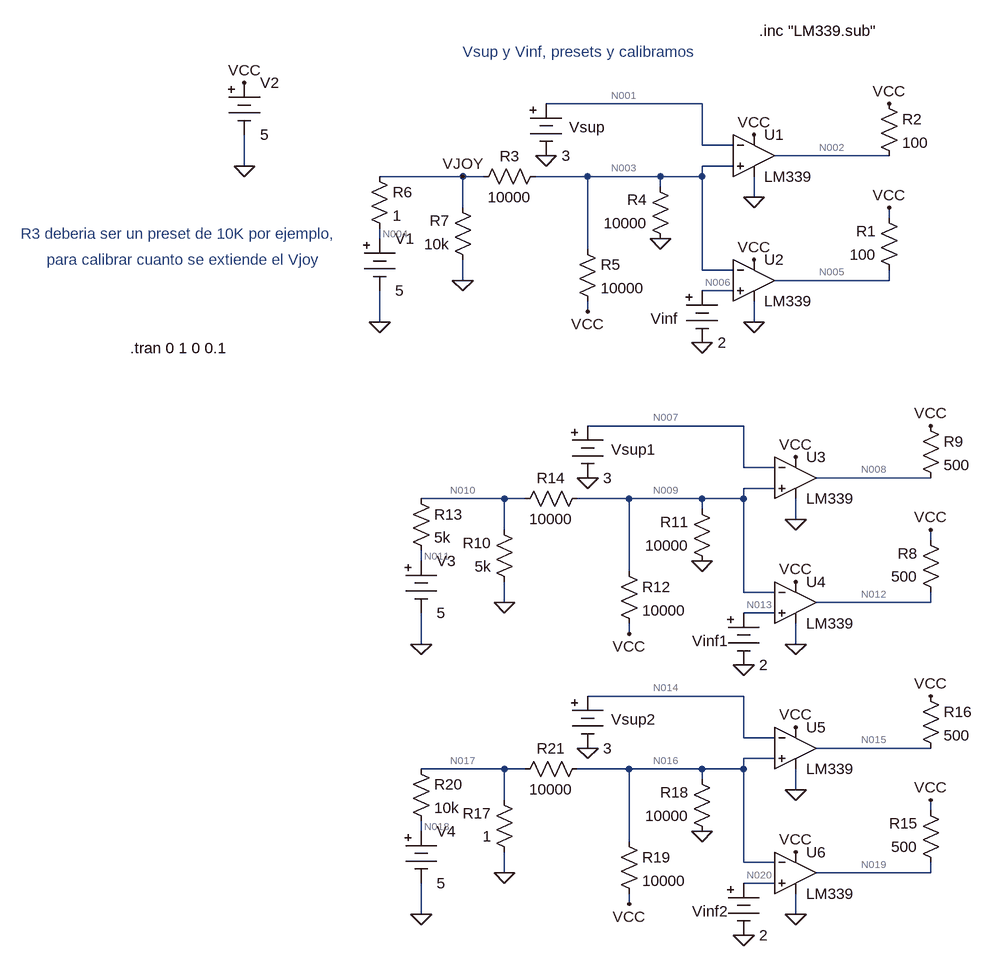
[diagram p0: schematic joystick_sim.asc]
joystick_sim.asc, the LTspice schematic file:
Version 4
SHEET 1 1540 1484
WIRE 64 160 -176 160
WIRE 64 224 64 160
WIRE 112 224 64 224
WIRE 352 240 176 240
WIRE -640 256 -640 208
WIRE 112 256 64 256
WIRE -304 272 -432 272
WIRE -272 272 -304 272
WIRE -112 272 -192 272
WIRE 0 272 -112 272
WIRE 64 272 64 256
WIRE 64 272 0 272
WIRE 0 288 0 272
WIRE 144 304 144 272
WIRE -304 320 -304 272
WIRE 352 336 352 320
WIRE -432 368 -432 352
WIRE -112 384 -112 272
WIRE 64 416 64 272
WIRE 112 416 64 416
WIRE -304 432 -304 400
WIRE 352 432 352 416
WIRE 352 432 176 432
WIRE 112 448 64 448
WIRE -112 480 -112 464
WIRE -432 496 -432 448
WIRE 144 496 144 464
WIRE 128 656 -112 656
WIRE 128 720 128 656
WIRE 176 720 128 720
WIRE 416 736 240 736
WIRE 176 752 128 752
WIRE -240 768 -368 768
WIRE -208 768 -240 768
WIRE -48 768 -128 768
WIRE 64 768 -48 768
WIRE 128 768 128 752
WIRE 128 768 64 768
WIRE 64 784 64 768
WIRE 208 800 208 768
WIRE -240 816 -240 768
WIRE 416 832 416 816
WIRE -368 864 -368 848
WIRE -48 880 -48 768
WIRE 128 912 128 768
WIRE 176 912 128 912
WIRE -240 928 -240 896
WIRE 416 928 416 912
WIRE 416 928 240 928
WIRE 176 944 128 944
WIRE -48 976 -48 960
WIRE -368 992 -368 944
WIRE 208 992 208 960
WIRE 128 1072 -112 1072
WIRE 128 1136 128 1072
WIRE 176 1136 128 1136
WIRE 416 1152 240 1152
WIRE 176 1168 128 1168
WIRE -240 1184 -368 1184
WIRE -208 1184 -240 1184
WIRE -48 1184 -128 1184
WIRE 64 1184 -48 1184
WIRE 128 1184 128 1168
WIRE 128 1184 64 1184
WIRE 64 1200 64 1184
WIRE 208 1216 208 1184
WIRE -240 1232 -240 1184
WIRE 416 1248 416 1232
WIRE -368 1280 -368 1264
WIRE -48 1296 -48 1184
WIRE 128 1328 128 1184
WIRE 176 1328 128 1328
WIRE -240 1344 -240 1312
WIRE 416 1344 416 1328
WIRE 416 1344 240 1344
WIRE 176 1360 128 1360
WIRE -48 1392 -48 1376
WIRE -368 1408 -368 1360
WIRE 208 1408 208 1376
FLAG -640 256 0
FLAG -640 128 VCC
FLAG 144 208 VCC
FLAG 144 304 0
FLAG -176 240 0
FLAG 64 528 0
FLAG 144 400 VCC
FLAG 144 496 0
FLAG 352 160 VCC
FLAG 352 320 VCC
FLAG 0 368 0
FLAG -112 480 VCC
FLAG -432 496 0
FLAG -304 432 0
FLAG 208 704 VCC
FLAG 208 800 0
FLAG -112 736 0
FLAG 128 1024 0
FLAG 208 896 VCC
FLAG 208 992 0
FLAG 416 656 VCC
FLAG 416 816 VCC
FLAG 64 864 0
FLAG -48 976 VCC
FLAG -368 992 0
FLAG -240 928 0
FLAG 208 1120 VCC
FLAG 208 1216 0
FLAG -112 1152 0
FLAG 128 1440 0
FLAG 208 1312 VCC
FLAG 208 1408 0
FLAG 416 1072 VCC
FLAG 416 1232 VCC
FLAG 64 1280 0
FLAG -48 1392 VCC
FLAG -368 1408 0
FLAG -240 1344 0
FLAG -304 272 VJOY
SYMBOL Opamps\\opamp2 144 176 R0
SYMATTR InstName U1
SYMATTR Value LM339
SYMATTR SpiceModel LM339
SYMBOL Misc\\battery -640 112 R0
WINDOW 123 0 0 Left 0
WINDOW 39 0 0 Left 0
SYMATTR InstName V2
SYMATTR Value 5
SYMBOL Opamps\\opamp2 144 368 R0
SYMATTR InstName U2
SYMATTR Value LM339
SYMATTR SpiceModel LM339
SYMBOL Misc\\battery -176 144 R0
WINDOW 123 0 0 Left 0
WINDOW 39 0 0 Left 0
WINDOW 0 36 52 Left 2
SYMATTR InstName Vsup
SYMATTR Value 3
SYMBOL Misc\\battery 64 432 R0
WINDOW 123 0 0 Left 0
WINDOW 39 0 0 Left 0
WINDOW 0 -79 59 Left 2
SYMATTR InstName Vinf
SYMATTR Value 2
SYMBOL res 368 432 R180
WINDOW 0 36 76 Left 2
WINDOW 3 36 40 Left 2
SYMATTR InstName R1
SYMATTR Value 100
SYMBOL res 336 144 R0
SYMATTR InstName R2
SYMATTR Value 100
SYMBOL res -288 416 R180
WINDOW 0 36 76 Left 2
WINDOW 3 36 40 Left 2
SYMATTR InstName R7
SYMATTR Value 10k
SYMBOL res 16 384 R180
WINDOW 0 36 76 Left 2
WINDOW 3 36 40 Left 2
SYMATTR InstName R4
SYMATTR Value 10000
SYMBOL res -128 368 R0
SYMATTR InstName R5
SYMATTR Value 10000
SYMBOL Misc\\battery -432 352 R0
WINDOW 123 0 0 Left 0
WINDOW 39 0 0 Left 0
SYMATTR InstName V1
SYMATTR Value 5
SYMBOL res -448 256 R0
SYMATTR InstName R6
SYMATTR Value 1
SYMBOL res -176 256 R90
WINDOW 0 0 56 VBottom 2
WINDOW 3 32 56 VTop 2
SYMATTR InstName R3
SYMATTR Value 10000
SYMBOL Opamps\\opamp2 208 672 R0
SYMATTR InstName U3
SYMATTR Value LM339
SYMATTR SpiceModel LM339
SYMBOL Opamps\\opamp2 208 864 R0
SYMATTR InstName U4
SYMATTR Value LM339
SYMATTR SpiceModel LM339
SYMBOL Misc\\battery -112 640 R0
WINDOW 123 0 0 Left 0
WINDOW 39 0 0 Left 0
WINDOW 0 36 52 Left 2
SYMATTR InstName Vsup1
SYMATTR Value 3
SYMBOL Misc\\battery 128 928 R0
WINDOW 123 0 0 Left 0
WINDOW 39 0 0 Left 0
WINDOW 0 -79 59 Left 2
SYMATTR InstName Vinf1
SYMATTR Value 2
SYMBOL res 432 928 R180
WINDOW 0 36 76 Left 2
WINDOW 3 36 40 Left 2
SYMATTR InstName R8
SYMATTR Value 500
SYMBOL res 400 640 R0
SYMATTR InstName R9
SYMATTR Value 500
SYMBOL res -224 912 R180
WINDOW 0 36 76 Left 2
WINDOW 3 36 40 Left 2
SYMATTR InstName R10
SYMATTR Value 5k
SYMBOL res 80 880 R180
WINDOW 0 36 76 Left 2
WINDOW 3 36 40 Left 2
SYMATTR InstName R11
SYMATTR Value 10000
SYMBOL res -64 864 R0
SYMATTR InstName R12
SYMATTR Value 10000
SYMBOL Misc\\battery -368 848 R0
WINDOW 123 0 0 Left 0
WINDOW 39 0 0 Left 0
SYMATTR InstName V3
SYMATTR Value 5
SYMBOL res -384 752 R0
SYMATTR InstName R13
SYMATTR Value 5k
SYMBOL res -112 752 R90
WINDOW 0 0 56 VBottom 2
WINDOW 3 32 56 VTop 2
SYMATTR InstName R14
SYMATTR Value 10000
SYMBOL Opamps\\opamp2 208 1088 R0
SYMATTR InstName U5
SYMATTR Value LM339
SYMATTR SpiceModel LM339
SYMBOL Opamps\\opamp2 208 1280 R0
SYMATTR InstName U6
SYMATTR Value LM339
SYMATTR SpiceModel LM339
SYMBOL Misc\\battery -112 1056 R0
WINDOW 123 0 0 Left 0
WINDOW 39 0 0 Left 0
WINDOW 0 36 52 Left 2
SYMATTR InstName Vsup2
SYMATTR Value 3
SYMBOL Misc\\battery 128 1344 R0
WINDOW 123 0 0 Left 0
WINDOW 39 0 0 Left 0
WINDOW 0 -79 59 Left 2
SYMATTR InstName Vinf2
SYMATTR Value 2
SYMBOL res 432 1344 R180
WINDOW 0 36 76 Left 2
WINDOW 3 36 40 Left 2
SYMATTR InstName R15
SYMATTR Value 500
SYMBOL res 400 1056 R0
SYMATTR InstName R16
SYMATTR Value 500
SYMBOL res -224 1328 R180
WINDOW 0 36 76 Left 2
WINDOW 3 36 40 Left 2
SYMATTR InstName R17
SYMATTR Value 1
SYMBOL res 80 1296 R180
WINDOW 0 36 76 Left 2
WINDOW 3 36 40 Left 2
SYMATTR InstName R18
SYMATTR Value 10000
SYMBOL res -64 1280 R0
SYMATTR InstName R19
SYMATTR Value 10000
SYMBOL Misc\\battery -368 1264 R0
WINDOW 123 0 0 Left 0
WINDOW 39 0 0 Left 0
SYMATTR InstName V4
SYMATTR Value 5
SYMBOL res -384 1168 R0
SYMATTR InstName R20
SYMATTR Value 10k
SYMBOL res -112 1168 R90
WINDOW 0 0 56 VBottom 2
WINDOW 3 32 56 VTop 2
SYMATTR InstName R21
SYMATTR Value 10000
TEXT 152 48 Left 2 !.inc "LM339.sub"
TEXT -816 536 Left 2 !.tran 0 1 0 0.1
TEXT -984 360 Left 2 ;R3 deberia ser un preset de 10K por ejemplo,
TEXT -944 400 Left 2 ;para calibrar cuanto se extiende el Vjoy
TEXT -304 80 Left 2 ;Vsup y Vinf, presets y calibramos

The netlist it stands for:
* joystick_sim.asc
XU1 N003 N001 VCC 0 N002 LM339 LM339  ; pins In+ In- V+ V- OUT
V2 VCC 0 5
XU2 N006 N003 VCC 0 N005 LM339 LM339  ; pins In+ In- V+ V- OUT
Vsup N001 0 3
Vinf N006 0 2
R1 N005 VCC 100
R2 VCC N002 100
R7 0 VJOY 10k
R4 0 N003 10000
R5 N003 VCC 10000
V1 N004 0 5
R6 VJOY N004 1
R3 N003 VJOY 10000
XU3 N009 N007 VCC 0 N008 LM339 LM339  ; pins In+ In- V+ V- OUT
XU4 N013 N009 VCC 0 N012 LM339 LM339  ; pins In+ In- V+ V- OUT
Vsup1 N007 0 3
Vinf1 N013 0 2
R8 N012 VCC 500
R9 VCC N008 500
R10 0 N010 5k
R11 0 N009 10000
R12 N009 VCC 10000
V3 N011 0 5
R13 N010 N011 5k
R14 N009 N010 10000
XU5 N016 N014 VCC 0 N015 LM339 LM339  ; pins In+ In- V+ V- OUT
XU6 N020 N016 VCC 0 N019 LM339 LM339  ; pins In+ In- V+ V- OUT
Vsup2 N014 0 3
Vinf2 N020 0 2
R15 N019 VCC 500
R16 VCC N015 500
R17 0 N017 1
R18 0 N016 10000
R19 N016 VCC 10000
V4 N018 0 5
R20 N017 N018 10k
R21 N016 N017 10000
.inc "LM339.sub"
.tran 0 1 0 0.1
* R3 deberia ser un preset de 10K por ejemplo,
* para calibrar cuanto se extiende el Vjoy
* Vsup y Vinf, presets y calibramos
.backanno
.end

* Results of the author's LTspice run, read from the files saved beside the schematic
* Operating Point, zero values left out:
*   V(vcc) = 5 V
*   V(n003) = 3.333 V
*   V(n001) = 3 V
*   V(n002) = 5 V
*   V(n006) = 2 V
*   V(n005) = 160.6 mV
*   V(vjoy) = 4.999 V
*   V(n004) = 5 V
*   V(n009) = 2.5 V
*   V(n007) = 3 V
*   V(n008) = 119.2 mV
*   V(n013) = 2 V
*   V(n012) = 119.2 mV
*   V(n010) = 2.5 V
*   V(n011) = 5 V
*   V(n016) = 1.667 V
*   V(n014) = 3 V
*   V(n015) = 119.2 mV
*   V(n020) = 2 V
*   V(n019) = 5 V
*   V(n017) = 666.6 µV
*   V(n018) = 5 V
*   I(R21) = 166.7 µA
*   I(R20) = -499.9 µA
*   I(R19) = -333.3 µA
*   I(R18) = -166.7 µA
*   I(R17) = -666.6 µA
*   I(R16) = 9.762 mA
*   I(R15) = -4.984 pA
*   I(R14) = 14.28 nA
*   I(R13) = -500 µA
*   I(R12) = -250 µA
*   I(R11) = -250 µA
*   I(R10) = -500 µA
*   I(R9) = 9.762 mA
*   I(R8) = -9.762 mA
*   I(R3) = -166.6 µA
*   I(R6) = -666.6 µA
*   I(R5) = -166.7 µA
*   I(R4) = -333.3 µA
*   I(R7) = -499.9 µA
*   I(R2) = 4.984 pA
*   I(R1) = -48.39 mA
*   I(V4) = -499.9 µA
*   I(Vinf2) = -2.276 pA
*   I(Vsup2) = -4.205 pA
*   I(V3) = -500 µA
*   I(Vinf1) = 49.97 nA
*   I(Vsup1) = -3.369 pA
*   I(V1) = -666.6 µA
*   I(Vinf) = 49.97 nA
*   I(Vsup) = 49.97 nA
*   I(V2) = -79.28 mA